# Altium schematic sheet Elekid_01.SchDoc
size A4
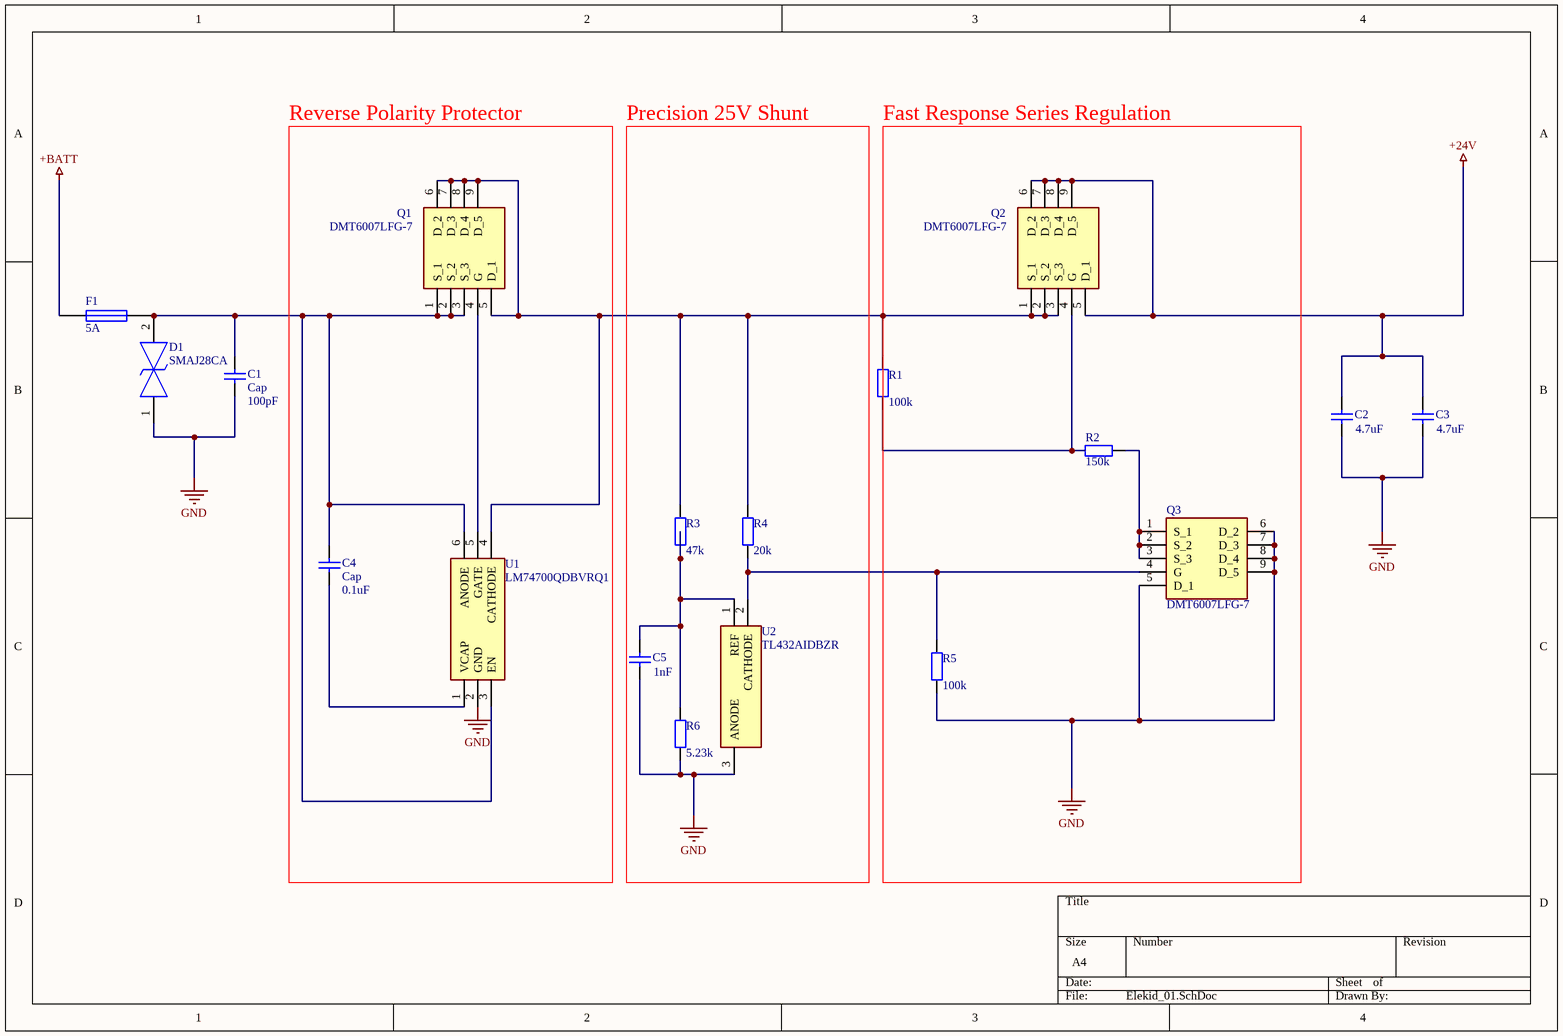
[diagram p0: Elekid_01.SchDoc]

## Parts
C1  Cap  value 100pF  [C0805]
C2  value 4.7uF  [C0805]  (hidden comment: Cap)
C3  value 4.7uF  [C0805]  (hidden comment: Cap)
C4  Cap  value 0.1uF  [C0805]
C5  value 1nF  [C0805]  (hidden comment: Cap)
D1  SMAJ28CA  [DIONM5226X262N]
F1  5A  [PIN-W2/E2.8]
Q1  DMT6007LFG-7  [DMT6007LFG7]
Q2  DMT6007LFG-7  [DMT6007LFG7]
Q3  DMT6007LFG-7  [DMT6007LFG7]
R1  value 100k  [C0805]  (hidden comment: Res2)
R2  value 150k  [C0805]  (hidden comment: Res2)
R3  value 47k  [C0805]  (hidden comment: Res2)
R4  value 20k  [C0805]  (hidden comment: Res2)
R5  value 100k  [C0805]  (hidden comment: Res2)
R6  value 5.23k  [C0805]  (hidden comment: Res2)
U1  LM74700QDBVRQ1  [SOT95P280X145-6N]
U2  TL432AIDBZR  [SOT95P237X112-3N]

## Blocks framed on the sheet
Reverse Polarity Protector: C4 Q1 U1
Precision 25V Shunt: C5 R3 R4 R6 U2
Fast Response Series Regulation: Q2 Q3 R1 R2 R5

## Nets
+24V: C2.2 C3.2 Q2.5(D_1) Q2.6(D_2) Q2.7(D_3) Q2.8(D_4) Q2.9(D_5)
+BATT: F1.1
GND: C1.1 C2.1 C3.1 C5.1 D1.1 Q3.5(D_1) Q3.6(D_2) Q3.7(D_3) Q3.8(D_4) Q3.9(D_5) R5.1 R6.1 U1.2(GND) U2.3(ANODE)
NetC1_2: C1.2 C4.2 D1.2 F1.2 Q1.1(S_1) Q1.2(S_2) Q1.3(S_3) U1.3(EN) U1.6(ANODE)
NetC4_1: C4.1 U1.1(VCAP)
NetC5_2: C5.2 R3.1 R6.2 U2.1(REF)
NetQ1_4: Q1.4(G) U1.5(GATE)
NetQ1_5: Q1.5(D_1) Q1.6(D_2) Q1.7(D_3) Q1.8(D_4) Q1.9(D_5) Q2.1(S_1) Q2.2(S_2) Q2.3(S_3) R1.2 R3.2 R4.2 U1.4(CATHODE)
NetQ2_4: Q2.4(G) R1.1 R2.2
NetQ3_1: Q3.1(S_1) Q3.2(S_2) Q3.3(S_3) R2.1
NetQ3_4: Q3.4(G) R4.1 R5.2 U2.2(CATHODE)

## Library data of the parts
C1-C5 = Cap: Capacitor; Published: 8-Jun-2000; LatestRevisionDate: 17-Jul-2002; LatestRevisionNote: Re-released for DXP Platform.; PackageReference: RAD-0.3; Publisher: Altium Limited; PackageDescription: Radial Cap, Thru-Hole; 2 Leads; 0.3 in Pin Spacing
D1 = SMAJ28CA: TVS Diode (Bi-directional); Manufacturer_Name: Bourns; Datasheet Link: https://www.bourns.com/data/global/pdfs/SMAJ.pdf; Height: 2.62mm; Manufacturer_Part_Number: SMAJ28CA; Arrow Part Number: SMAJ28CA; Arrow Price/Stock: https://www.arrow.com/en/products/smaj28ca/bourns; Mouser Part Number: 652-SMAJ28CA; Mouser Price/Stock: https://www.mouser.co.uk/ProductDetail/Bourns/SMAJ28CA?qs=A3H9pljuJ8Rc2FOBsYvsOw%3D%3D
F1 = Fuse 1: Fuse; Published: 8-Jun-2000; LatestRevisionDate: 17-Jul-2002; LatestRevisionNote: Re-released for DXP Platform.; PackageReference: PIN-W2/E2.8; Publisher: Altium Limited; PackageDescription: Thru-Hole; 2 Leads
Q1-Q3 = DMT6007LFG-7: MOSFET (N-Channel); Manufacturer_Name: Diodes Inc.; Datasheet Link: https://componentsearchengine.com/Datasheets/1/DMT6007LFG-7.pdf; Height: 0.85mm; Manufacturer_Part_Number: DMT6007LFG-7; Arrow Part Number: DMT6007LFG-7; Arrow Price/Stock: https://www.arrow.com/en/products/dmt6007lfg-7/diodes-incorporated; Mouser Part Number: 621-DMT6007LFG-7; Mouser Price/Stock: https://www.mouser.com/Search/Refine.aspx?Keyword=621-DMT6007LFG-7
R1-R6 = Res2: Resistor; Published: 8-Jun-2000; LatestRevisionDate: 17-Jul-2002; LatestRevisionNote: Re-released for DXP Platform.; PackageReference: AXIAL-0.4; Publisher: Altium Limited; PackageDescription: Axial Device, Thru-Hole; 2 Leads; 0.4 in Pin Spacing
U1 = LM74700QDBVRQ1: Integrated Circuit; Manufacturer_Name: Texas Instruments; Datasheet Link: http://www.ti.com/lit/gpn/LM74700-Q1; Height: 1.45mm; Manufacturer_Part_Number: LM74700QDBVRQ1; Arrow Part Number: LM74700QDBVRQ1; Arrow Price/Stock: https://www.arrow.com/en/products/lm74700qdbvrq1/texas-instruments; Mouser Part Number: 595-LM74700QDBVRQ1; Mouser Price/Stock: https://www.mouser.co.uk/ProductDetail/Texas-Instruments/LM74700QDBVRQ1?qs=j%252B1pi9TdxUYjAZhGV8eSkQ%3D%3D
U2 = TL432AIDBZR: Integrated Circuit; Manufacturer_Name: Texas Instruments; Datasheet Link: http://www.ti.com/lit/gpn/tl432a; Height: 1.12mm; Manufacturer_Part_Number: TL432AIDBZR; Arrow Part Number: TL432AIDBZR; Arrow Price/Stock: https://www.arrow.com/en/products/tl432aidbzr/texas-instruments; Mouser Part Number: 595-TL432AIDBZR; Mouser Price/Stock: https://www.mouser.co.uk/ProductDetail/Texas-Instruments/TL432AIDBZR?qs=odmYgEirbwzw%252BopYvrzCyA%3D%3D